# EAGLE schematic MD-schematic (EAGLE 9.6.2)
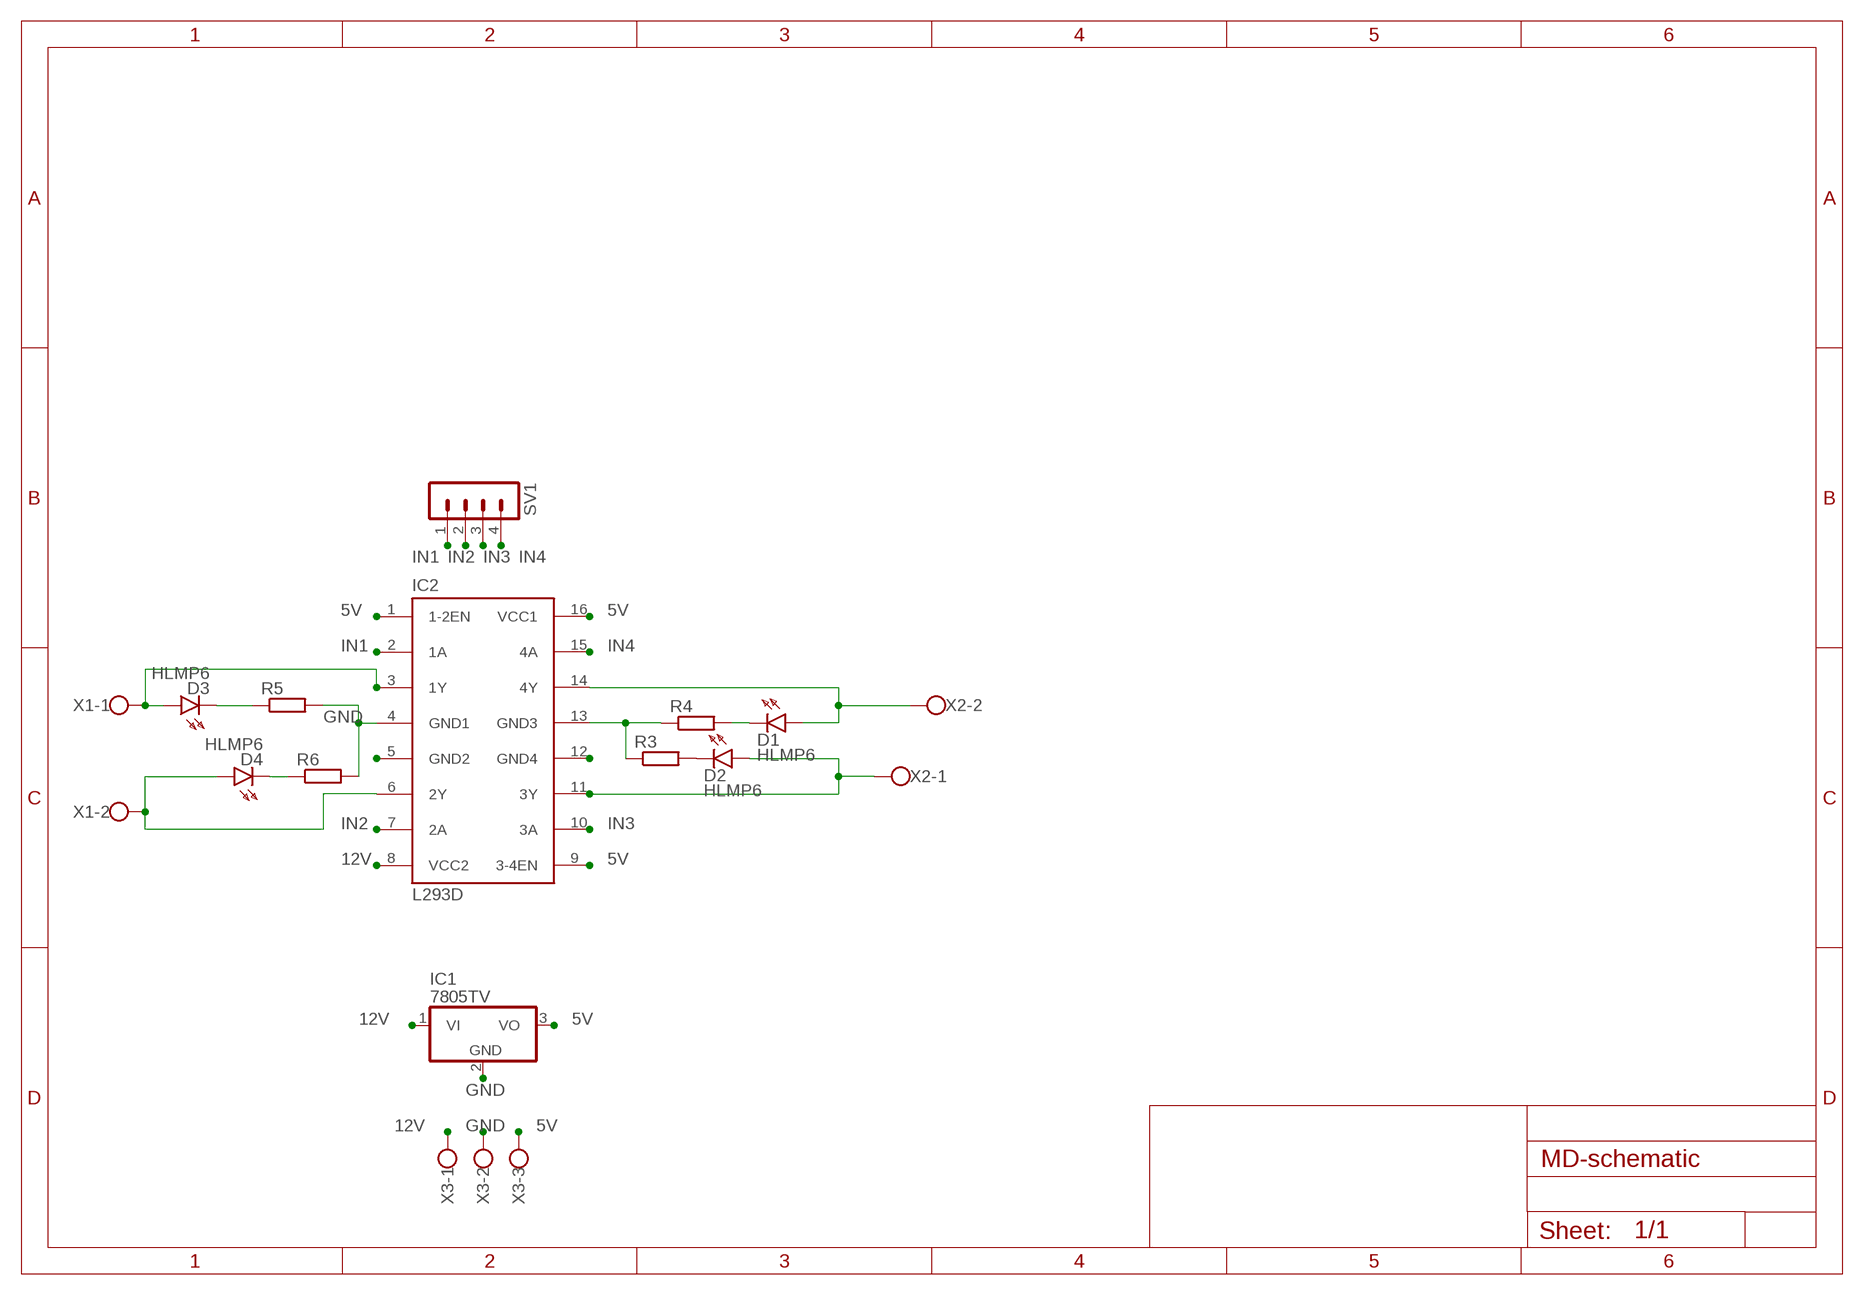
[diagram p0: schematic, sheet 1]

## Parts
D1  HLMP6  [HLMP6]
D2  HLMP6  [HLMP6]
D3  HLMP6  [HLMP6]
D4  HLMP6  [HLMP6]
IC1  7805TV  [TO220V]
IC2  L293D  [DIL16]
R3  R-EU_0204/5  [0204/5]
R4  R-EU_0204/5  [0204/5]
R5  R-EU_0204/5  [0204/5]
R6  R-EU_0204/5  [0204/5]
SV1  MA04-1  [MA04-1]
X1  W237-102  [W237-102]
X2  W237-102  [W237-102]
X3  W237-103  [W237-103]

## Nets
5V: IC1.3(VO) IC2.1(1-2EN) IC2.9(3-4EN) IC2.16(VCC1) X3.3
12V: IC1.1(VI) IC2.8(VCC2) X3.1
GND: IC1.2(GND) IC2.4(GND1) R5.2 R6.2 X3.2
IN1: IC2.2(1A) SV1.1
IN2: IC2.7(2A) SV1.2
IN3: IC2.10(3A) SV1.3
IN4: IC2.15(4A) SV1.4
N$1: D1.K R4.2
N$2: D1.A IC2.14(4Y) X2.2
N$3: IC2.12(GND4)
N$4: IC2.5(GND2)
N$5: IC2.13(GND3) R3.1 R4.1
N$6: D2.K R3.2
N$7: D3.K R5.1
N$8: D4.A IC2.6(2Y) X1.2
N$9: D4.K R6.1
OUT1: D3.A IC2.3(1Y) X1.1
OUT4: D2.A IC2.11(3Y) X2.1

## Library data of the parts
D1-D4 = display-hp:HLMP6: LED 2mm horizontal; MF: AGILENT TECHNOLOGIES; MPN: HLMP-6500; OC_FARNELL: 1652490; OC_NEWARK: 40K0088
IC1 = linear:78*: Positive VOLTAGE REGULATOR Source: http://cache.national.com/ds/LM/LM78L05.pdf http://www.fairchildsemi.com/ds/LM/LM7805.pdf
IC2 = st-microelectronics:L293D: PUSH-PULL 4 CHANNEL DRIVER; MPN: L293D; OC_FARNELL: 9589619; OC_NEWARK: 56P8249
R3-R6 = rcl:R-EU_: RESISTOR, European symbol; SPICEPREFIX: R
SV1 = con-lstb:MA04-1: PIN HEADER; OC_FARNELL: unknown; OC_NEWARK: unknown
X1 X2 = con-wago-500:W237-102: WAGO SCREW CLAMP; MPN: 237-102; OC_FARNELL: unknown; OC_NEWARK: 70K9898
X3 = con-wago-500:W237-103: WAGO SCREW CLAMP; MPN: 237-103; OC_FARNELL: unknown; OC_NEWARK: 18M7116

## Net classes
0 default: width 1 mm, clearance 0.508 mm